# EAGLE schematic main_pa3 (EAGLE 4.11)
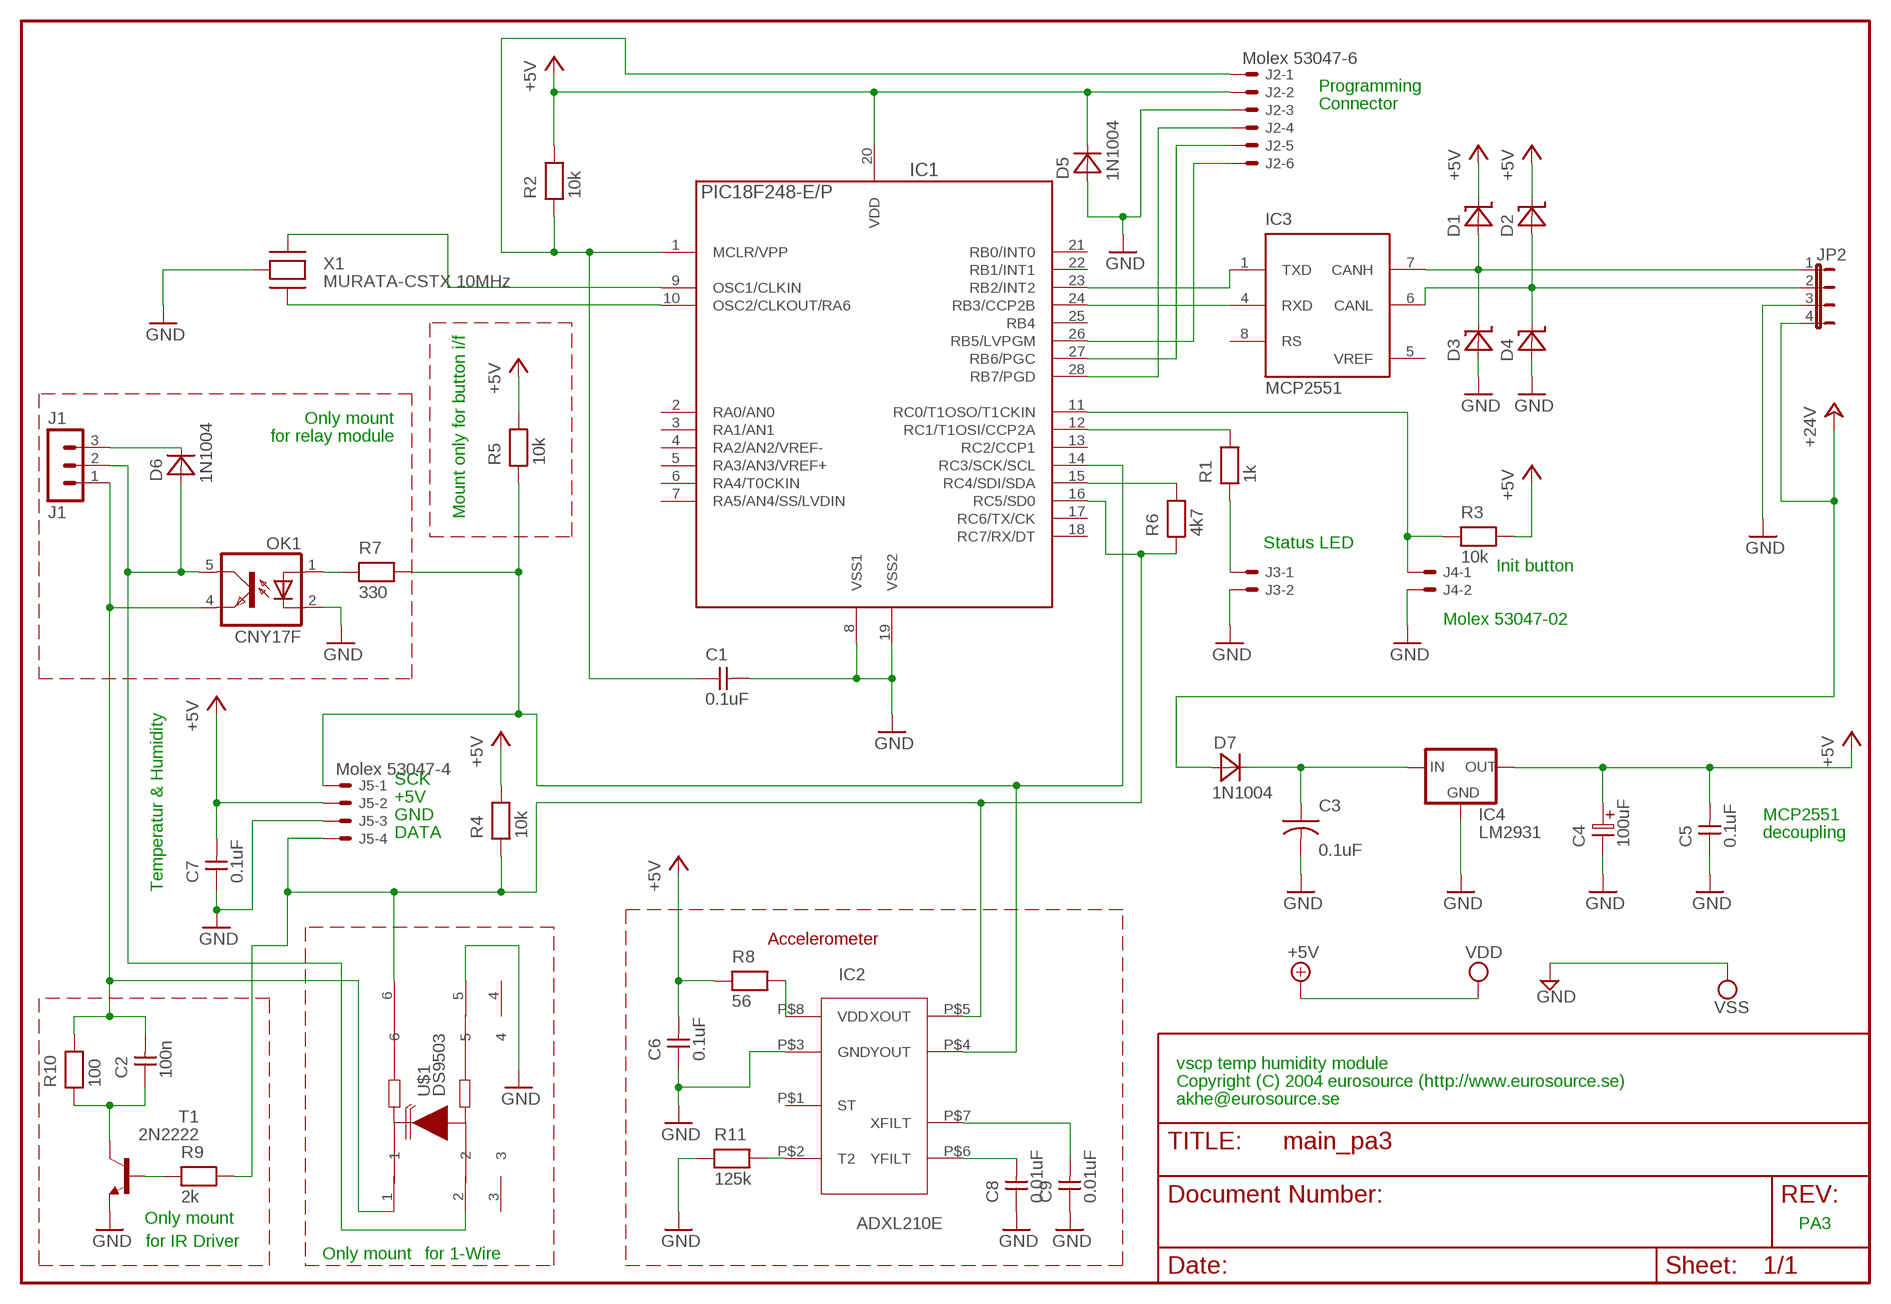
[diagram p0: schematic, sheet 1]

## Parts
C1  0.1uF  CAPNP-2,5  [C-2,5]
C2  100n  CAPNP-2,5  [C-2,5]
C3  0.1uF  CAP-5  [C-5]
C4  100uF  ELC-5  [ES-5]
C5  0.1uF  CAPNP-2,5  [C-2,5]
C6  0.1uF  CAPNP-2,5  [C-2,5]
C7  0.1uF  CAPNP-2,5  [C-2,5]
C8  0.01uF  CAPNP-2,5  [C-2,5]
C9  0.01uF  CAPNP-2,5  [C-2,5]
D1  ZDIO-2,5  [D-2,5]
D2  ZDIO-2,5  [D-2,5]
D3  ZDIO-2,5  [D-2,5]
D4  ZDIO-2,5  [D-2,5]
D5  1N1004  DIODE-7,5  [D-7,5]
D6  1N1004  DIODE-7,5  [D-7,5]
D7  1N1004  DIODE-7,5  [D-7,5]
IC1  PIC18F248-E/P  PIC18F252-E/P  [PDIP-28]
IC2  ADXL210E  [TSOC8]
IC3  MCP2551  MCP2551SN  [SO-08]
IC4  LM2931  78LXX  [78LXX]
J1  J1  MA03-1  [MA03-1]
J2  Molex 53047-6  53047-06  [53047-06]
J3  53047-02  [53047-02]
J4  53047-02  [53047-02]
J5  Molex 53047-4  53047-04  [53047-04]
JP2  JP4E  [JP4]
OK1  CNY17F  [DIL06]
R1  1k  RESEU-5  [R-5]
R2  10k  RESEU-5  [R-5]
R3  10k  RESEU-5  [R-5]
R4  10k  RESEU-5  [R-5]
R5  10k  RESEU-5  [R-5]
R6  4k7  RESEU-5  [R-5]
R7  330  RESEU-5  [R-5]
R8  56  RESEU-5  [R-5]
R9  2k  RESEU-5  [R-5]
R10  100  RESEU-5  [R-5]
R11  125k  RESEU-5  [R-5]
T1  2N2222  [TO18]
U$1  DS9503  [TSOC6]
X1  MURATA-CSTX 10MHz  MURATA-CSTX  [RESONATOR-MURATA]

## Nets
5V': IC2.P$8(VDD) R8.2
+5V: D5.2(K) IC1.20(VDD) J2.2 R2.2
+24V: D7.1(A) JP2.4
CANH: D1.1(A) D3.2(K) IC3.7(CANH) JP2.1
CANL: D2.1(A) D4.2(K) IC3.6(CANL) JP2.2
GND: C1.2 C3.2 C4.2 C5.1 C6.1 C7.1 C8.1 C9.1 D3.1(A) D4.1(A) D5.1(A) IC1.8(VSS1) IC1.9(OSC1/CLKIN) IC1.19(VSS2) IC2.P$3(GND) IC4.GND J2.3 J3.2 J4.2 J5.3 JP2.3 OK1.2(C) R11.1 T1.1(E) U$1.5 X1.1(XTIN) X1.2(GND) ; supply symbol labelled VSS
MCLR: C1.1 IC1.1(MCLR/VPP) J2.1 R2.1
N$1: IC1.10(OSC2/CLKOUT/RA6) X1.3(XTOUT)
N$2: IC1.12(RC1/T1OSI/CCP2A) R1.2
N$5: J3.1 R1.1
N$6: IC1.11(RC0/T1OSO/T1CKIN) J4.1 R3.1
N$8: OK1.1(A) R7.1
N$9: D6.2(K) J1.3
N$10: IC2.P$2(T2) R11.2
N$12: R9.1 T1.2(B)
N$13: C2.1 R10.1 T1.3(C)
N$22: C3.1 D7.2(K) IC4.IN
OWDATA: C2.2 J1.1 OK1.4(EMIT) R10.2 U$1.1
OWGND: D6.1(A) J1.2 OK1.5(COL) U$1.2
PGC: IC1.27(RB6/PGC) J2.5
PGD: IC1.28(RB7/PGD) J2.4
PGM: IC1.26(RB5/LVPGM) J2.6
RXCAN: IC1.24(RB3/CCP2B) IC3.4(RXD)
SCK: IC1.14(RC3/SCK/SCL) IC2.P$4(YOUT) J5.1 R5.1 R7.2
SDA: IC1.15(RC4/SDI/SDA) R6.2
SDO: IC1.16(RC5/SD0) IC2.P$5(XOUT) J5.4 R4.1 R6.1 R9.2 U$1.6
TXCAN: IC1.23(RB2/INT2) IC3.1(TXD)
VDD: C4.1 C5.2 C6.2 C7.2 D1.2(K) D2.2(K) IC4.OUT J5.2 R3.2 R4.2 R5.2 R8.1 ; supply symbol labelled +5V
XFILT: C9.2 IC2.P$7(XFILT)
YFILT: C8.2 IC2.P$6(YFILT)
Unconnected: IC1.2(RA0/AN0) IC1.3(RA1/AN1) IC1.4(RA2/AN2/VREF-) IC1.5(RA3/AN3/VREF+) IC1.6(RA4/T0CKIN) IC1.7(RA5/AN4/SS/LVDIN) IC1.13(RC2/CCP1) IC1.17(RC6/TX/CK) IC1.18(RC7/RX/DT) IC1.21(RB0/INT0) IC1.22(RB1/INT1) IC1.25(RB4) IC2.P$1(ST) IC3.8(RS) U$1.3 U$1.4

## Notes on the sheet
- Programming
- Connector
- Only mount
- for relay module
- Mount only for button i/f
- Status LED
- Init button
- Molex 53047-02
- SCK
- +5V
- GND | MCP2551
- DATA | decoupling
- Temperatur & Humidity
- Accelerometer
- vscp temp humidity module
- Copyright (C) 2004 eurosource (http://www.eurosource.se)
- akhe@eurosource.se
- Only mount
- PA3
- for IR Driver | Only mount | for 1-Wire

## Power pins joined to a net without a drawn wire
GND: IC3.2(VSS)
VDD: IC3.3(VDD)
VREF: IC3.5(VREF)

## Library data of the parts
C1 C2 C5-C9 = discrete:CAPNP-2,5
C3 = discrete:CAP-5
C4 = discrete:ELC-5
D1-D4 = discrete:ZDIO-2,5
D5-D7 = discrete:DIODE-7,5
IC1 = pic18:PIC18*F252-?: 18F252, 28 pin, 32Kb prog, 1536 data, 256 EEPROM
IC2 = eurosource_dallas:ADXL210E
IC3 = microchip_can:MCP2551: High Speed CAN tranceiver
IC4 = v-reg:78LXX: VOLTAGE REGULATOR
J1 = con-lstb:MA03-1: PIN HEADER
J2 = con-molex:53?-06: CONNECTOR wire to board 1.25 mm (.049 inch) pitch header
J3 J4 = con-molex:53?-02: CONNECTOR wire to board 1.25 mm (.049 inch) pitch header
J5 = con-molex:53?-04: CONNECTOR wire to board 1.25 mm (.049 inch) pitch header
JP2 = jumper:JP4E: JUMPER
OK1 = optocoupler:CNY17F: SIEMENS OPTO COUPLER
R1-R11 = discrete:RESEU-5
T1 = transistor:2N2222: NPN TRANSISTOR
U$1 = eurosource_dallas:DS9503
X1 = eurosource_ftdi:MURATA-CSTX